# EAGLE design CiroAttuatore V1 (EAGLE 9.5.1)
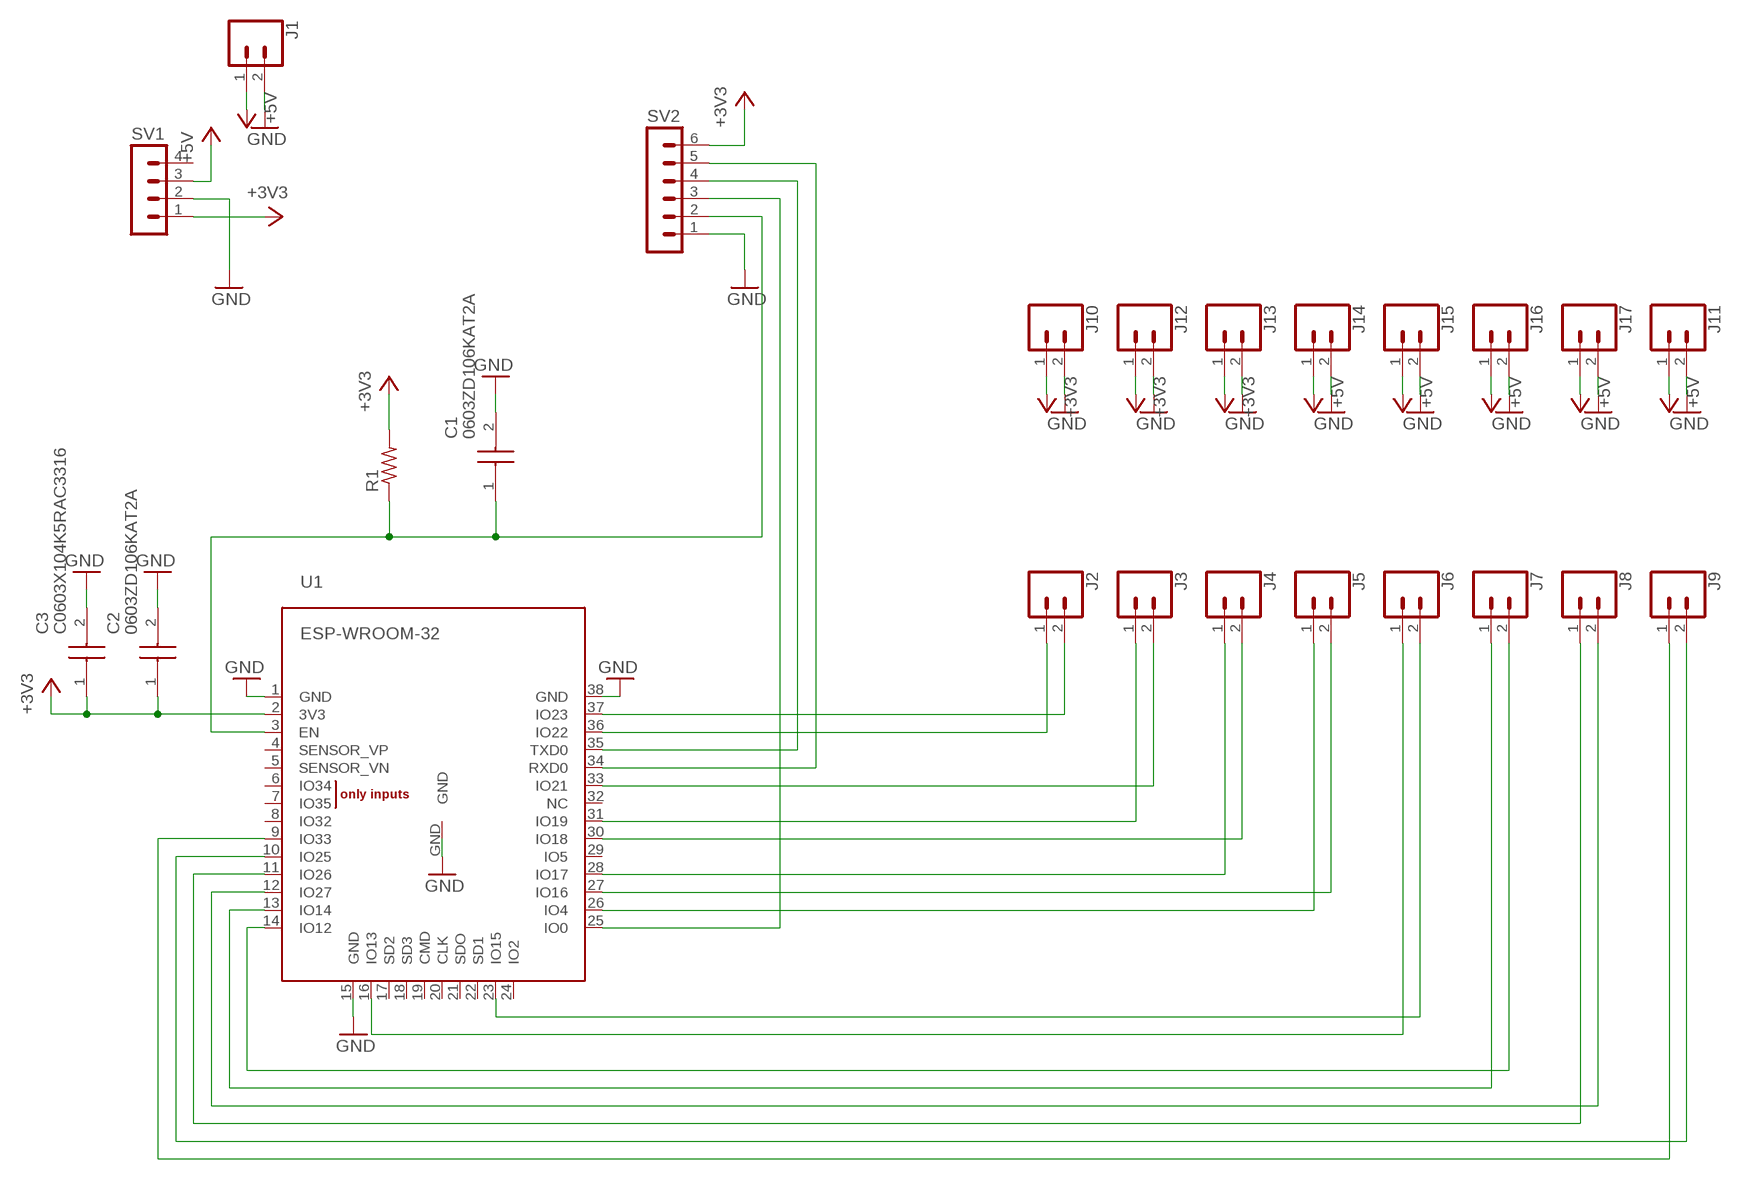
[diagram p0: schematic, sheet 1]

## Parts
C1  0603ZD106KAT2A  [CAPC1608X90N]
C2  0603ZD106KAT2A  [CAPC1608X90N]
C3  C0603X104K5RAC3316  [CAPC1608X95N]
J1  CONN_025MM  [SCREWTERMINAL-5MM-2]
J2  CONN_025MM  [SCREWTERMINAL-5MM-2]
J3  CONN_025MM  [SCREWTERMINAL-5MM-2]
J4  CONN_025MM  [SCREWTERMINAL-5MM-2]
J5  CONN_025MM  [SCREWTERMINAL-5MM-2]
J6  CONN_025MM  [SCREWTERMINAL-5MM-2]
J7  CONN_025MM  [SCREWTERMINAL-5MM-2]
J8  CONN_025MM  [SCREWTERMINAL-5MM-2]
J9  CONN_025MM  [SCREWTERMINAL-5MM-2]
J10  CONN_025MM  [SCREWTERMINAL-5MM-2]
J11  CONN_025MM  [SCREWTERMINAL-5MM-2]
J12  CONN_025MM  [SCREWTERMINAL-5MM-2]
J13  CONN_025MM  [SCREWTERMINAL-5MM-2]
J14  CONN_025MM  [SCREWTERMINAL-5MM-2]
J15  CONN_025MM  [SCREWTERMINAL-5MM-2]
J16  CONN_025MM  [SCREWTERMINAL-5MM-2]
J17  CONN_025MM  [SCREWTERMINAL-5MM-2]
R1  R-US_R0603  [R0603]
SV1  MA04-1  [MA04-1]
SV2  MA06-1  [MA06-1]
U1  ESP-WROOM-32  [ESP-WROOM-32]

## Nets
+3V3: C2.1 C3.1 J10.1 J12.1 J13.1 R1.2 SV1.1 SV2.6 U1.2(3V3)
+5V: J1.1 J11.1 J14.1 J15.1 J16.1 J17.1 SV1.3
GND: C1.2 C2.2 C3.2 J1.2 J10.2 J11.2 J12.2 J13.2 J14.2 J15.2 J16.2 J17.2 SV1.2 SV2.1 U1.1(GND) U1.15(GND) U1.38(GND) U1.GND
N$1: J2.2 U1.37(IO23)
N$2: J2.1 U1.36(IO22)
N$4: J3.2 U1.33(IO21)
N$5: SV2.4 U1.35(TXD0)
N$6: SV2.5 U1.34(RXD0)
N$7: SV2.3 U1.25(IO0)
N$8: C1.1 R1.1 SV2.2 U1.3(EN)
N$9: J3.1 U1.31(IO19)
N$10: J4.2 U1.30(IO18)
N$11: J4.1 U1.28(IO17)
N$12: J5.2 U1.27(IO16)
N$13: J5.1 U1.26(IO4)
N$14: J6.2 U1.23(IO15)
N$15: J6.1 U1.16(IO13)
N$16: J7.2 U1.14(IO12)
N$17: J7.1 U1.13(IO14)
N$18: J8.2 U1.12(IO27)
N$19: J8.1 U1.11(IO26)
N$20: J9.2 U1.10(IO25)
N$21: J9.1 U1.9(IO33)
Unconnected: SV1.4 U1.4(SENSOR_VP) U1.5(SENSOR_VN) U1.6(IO34) U1.7(IO35) U1.8(IO32) U1.17(SD2) U1.18(SD3) U1.19(CMD) U1.20(CLK) U1.21(SDO) U1.22(SD1) U1.24(IO2) U1.29(IO5) U1.32(NC)

## Library data of the parts
C1 C2 = SamacSys_Parts:0603ZD106KAT2A: Multilayer Ceramic Capacitors MLCC - SMD/SMT 10V 10uF X5R 0603 10%TOL Source: Datasheet <https://componentsearchengine.com/Datasheets/1/0603ZD106KAT2A.pdf>; DESCRIPTION: Multilayer Ceramic Capacitors MLCC - SMD/SMT 10V 10uF X5R 0603 10%TOL; HEIGHT: 0.9mm; MANUFACTURER_NAME: AVX; MANUFACTURER_PART_NUMBER: 0603ZD106KAT2A; MOUSER_PART_NUMBER: 581-0603ZD106KAT2A; MOUSER_PRICE-STOCK: https://www.mouser.com/Search/Refine.aspx?Keyword=581-0603ZD106KAT2A
C3 = SamacSys_Parts:C0603X104K5RAC3316: Multilayer Ceramic Capacitors MLCC - SMD/SMT 50V .1uF X7R AUTO 5mm Flex VW80808 Source: Datasheet <https://componentsearchengine.com/Datasheets/1/C0603X104K5RAC3316.pdf>; DESCRIPTION: Multilayer Ceramic Capacitors MLCC - SMD/SMT 50V .1uF X7R AUTO 5mm Flex VW80808; HEIGHT: 0.95mm; MANUFACTURER_NAME: Kemet; MANUFACTURER_PART_NUMBER: C0603X104K5RAC3316; MOUSER_PART_NUMBER: 80-C0603X104K5R3316; MOUSER_PRICE-STOCK: https://www.mouser.com/Search/Refine.aspx?Keyword=80-C0603X104K5R3316
J1-J17 = SparkFun-Connectors:CONN_02: Multi connection point. Often used as Generic Header-pin footprint for 0.1 inch spaced/style header connections On any of the 0.1 inch spaced packages, you can populate with these: Break Away Headers - Straight <https://www.sparkfun.com/products/116> (PRT-00116) Break Away Male Headers - Right Angle <https://www.sparkfun.com/products/553> (PRT-00553) Female Headers <https://www.sparkfun.com/products/115> (PRT-00115) Break Away Headers - Machine Pin <https://www.sparkfun.com/products/117> (PRT-00117) Break Away Female Headers - Swiss Machine Pin <https://www.sparkfun.com/products/743> (PRT-00743) For SCREWTERMINALS and SPRING TERMINALS visit here: Screw Terimnals on SparkFun.com <https://www.sparkfun.com/search/results?term=Screw+Terminals> (5mm/3.5mm/2.54mm spacing) This device is also useful as a general connection point to wire up your design to another part of your project. Our various solder wires solder well into these plated through hole pads. Hook-Up Wire - Assortment (Stranded, 22 AWG) <https://www.sparkfun.com/products/11375> (PRT-11375) Hook-Up Wire - Assortment (Solid Core, 22 AWG) <https://www.sparkfun.com/products/11367> (PRT-11367) View the entire wire category on our website here <https://www.sparkfun.com/categories/141> Special notes: Molex polarized connector foot print use with: PRT-08233 with associated crimp pins and housings. 2.54_SCREWTERM for use with PRT-10571. 3.5mm Screw Terminal footprints for PRT-08084 5mm Screw Terminal footprints for use with PRT-08432; SF_SKU: PRT-08432
R1 = resistor:R-US_: RESISTOR, American symbol
SV1 = con-lstb:MA04-1: PIN HEADER; OC_FARNELL: unknown; OC_NEWARK: unknown
SV2 = con-lstb:MA06-1: PIN HEADER; OC_FARNELL: unknown; OC_NEWARK: unknown
U1 = esp32:ESP-WROOM-32

## Board
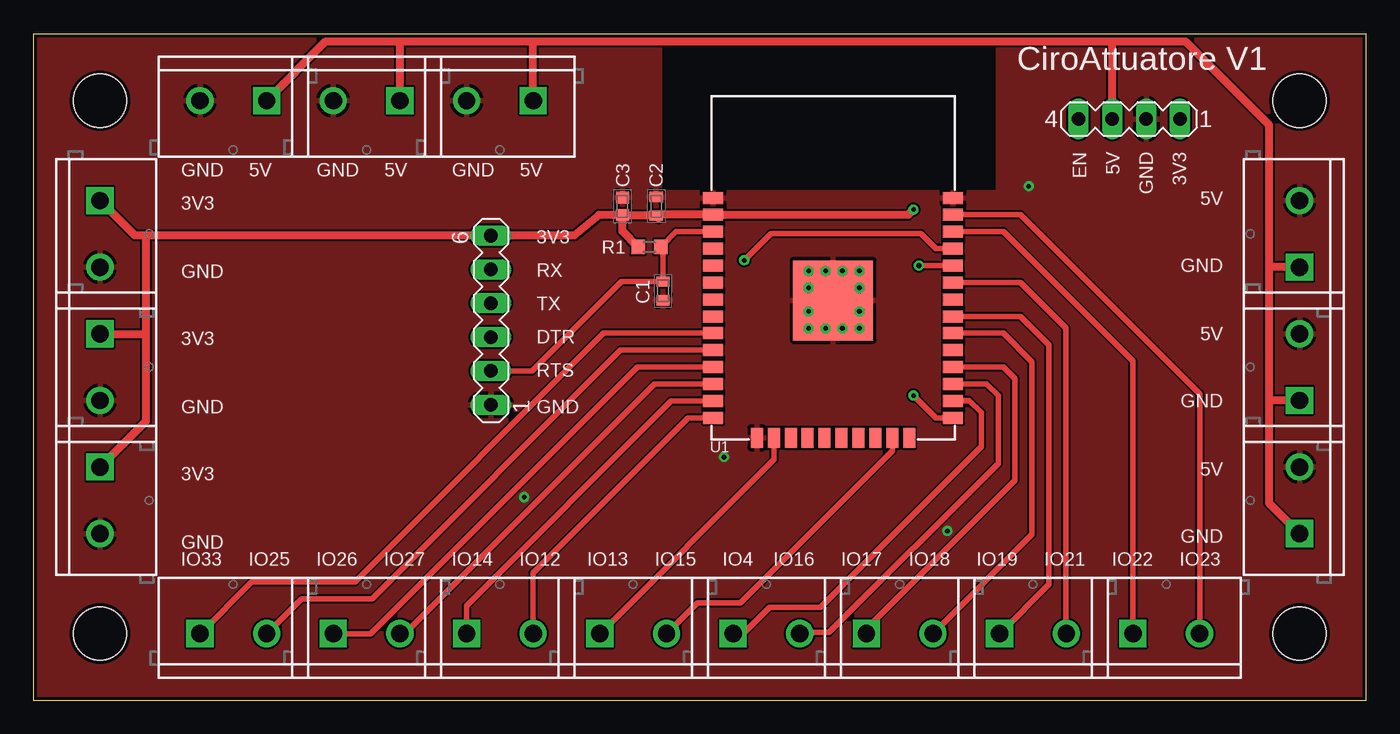
[diagram p1: board, top side]
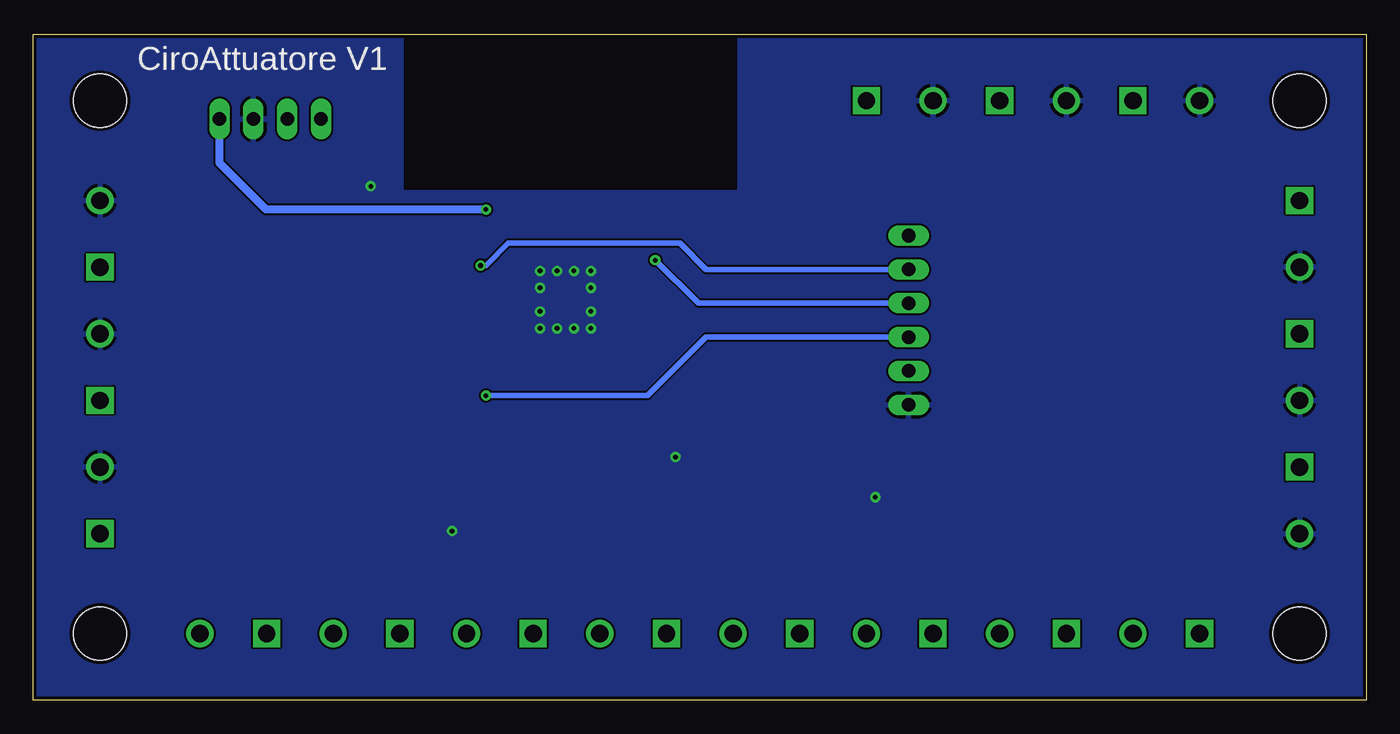
[diagram p2: board, bottom side, seen from below]

Size 100 x 50 mm. Coordinates in mm from the lower left corner, seen from the top.
Outline: 0,0 100,0 100,50 0,50 0,0
Copper layers (1*16): Top 0.035mm / dielectric 1.5mm / Bottom 0.035mm
Design rules "default *": minimum track width 6mil, minimum drill 0.35mm, track to track 6mil, track to pad 6mil, pad to pad 6mil, via to via 6mil, smd to smd 6mil, copper to edge 10mil, drill to drill 6mil, minimum pad ring 10mil, minimum via ring 8mil, stop-mask expansion 4mil, vias tented up to drill 0mil, thermal gap 10mil
Holes 4 mm at 95,45 5,45 5,5 95,5

### Footprints (pad centres in the part's own frame; a part is rotated, then mirrored left to right if it is on the bottom)
CAPC1608X90N = smd 0.78 x 0.99: 1 -0.7,0; 2 0.7,0
CAPC1608X95N = smd 0.89 x 0.98: 1 -0.65,0; 2 0.65,0
SCREWTERMINAL-5MM-2 = drill 1.3 pad 2.032 square: 1 0,0 | drill 1.3 pad 2.032: 2 5,0
R0603 = smd 1 x 1.1: 1 -0.85,0; 2 0.85,0
MA04-1 = drill 1.016 long: 1 -3.81,0; 2 -1.27,0; 3 1.27,0; 4 3.81,0
MA06-1 = drill 1.016 long: 1 -6.35,0; 2 -3.81,0; 3 -1.27,0; 4 1.27,0; 5 3.81,0; 6 6.35,0
ESP-WROOM-32 = smd 0.9 x 1.5: 1 7.7,9; 2 6.43,9; 3 5.16,9; 4 3.89,9; 5 2.62,9; 6 1.35,9; 7 0.08,9; 8 -1.19,9; 9 -2.46,9; 10 -3.73,9; 11 -5,9; 12 -6.27,9; 13 -7.54,9; 14 -8.81,9; 25 -8.81,-9; 26 -7.54,-9; 27 -6.27,-9; 28 -5,-9; 29 -3.73,-9; 30 -2.46,-9; 31 -1.19,-9; 32 0.08,-9; 33 1.35,-9; 34 2.62,-9; 35 3.89,-9; 36 5.16,-9; 37 6.43,-9; 38 7.7,-9 | smd 1.5 x 0.9: 15 -10.3,5.715; 16 -10.3,4.445; 17 -10.3,3.175; 18 -10.3,1.905; 19 -10.3,0.635; 20 -10.3,-0.635; 21 -10.3,-1.905; 22 -10.3,-3.175; 23 -10.3,-4.445; 24 -10.3,-5.715 | smd 6 x 6: GND 0,0

### Placement (x,y rotation side)
C1  47.24,30.72 270 top
C2  46.74,37.07 90 top
C3  44.2,37.07 90 top
J1  95,22.5 90 top
J2  82.5,5 0 top
J3  72.5,5 0 top
J4  62.5,5 0 top
J5  52.5,5 0 top
J6  42.5,5 0 top
J7  32.5,5 0 top
J8  22.5,5 0 top
J9  12.5,5 0 top
J10  5,37.5 270 top
J11  95,32.5 90 top
J12  5,17.5 270 top
J13  5,27.5 270 top
J14  95,12.5 90 top
J15  17.5,45 180 top
J16  27.5,45 180 top
J17  37.5,45 180 top
R1  46.23,34.02 180 top
SV1  82.22,43.62 180 top
SV2  34.33,28.52 90 top
U1  60,30 90 top

### Tracks (layer width: path | path; a pad name or v marks a point on that pad's centre or on a via)
+3V3  (via drill 0.35)
  Top 0.61: C3.1 44.25,36.37 C2.1 46.93,36.18 46.94,36.43 U1.2 65.64,36.43 v66.04,36.83 | R1.2 44.2,35.2 C3.1 | C3.1 42.43,36.42 40.59,34.87 SV2.6 8.45,34.87 | 8.45,34.87 7.63,34.87 J10.1 | J13.1 8.45,27.5 | J12.1 8.45,20.95 8.45,27.5 | 8.45,27.5 8.45,34.87
  Bottom 0.61: v66.04,36.83 82.55,36.83 86.03,40.31 SV1.1
+5V
  Top 0.61: J15.1 21.94,49.44 27.5,49.44 | J14.1 92.71,14.79 92.71,22.5 | 37.5,49.44 27.94,49.44 27.5,49.44 | 37.5,49.44 80.95,49.44 | 80.95,49.44 86.45,49.44 92.71,43.18 92.71,32.5 | 92.71,32.5 92.71,22.5 | J1.1 92.71,22.5 | J11.1 92.71,32.5 | SV1.3 80.95,49.44 | J17.1 37.5,49.44 | J16.1 27.5,49.44
GND  (via drill 0.35)
  other vias: 58.17,30.95 58.17,32.22 59.44,32.22 60.71,32.22 61.98,32.22 61.98,30.95 61.98,29.18 61.98,27.91 60.71,27.91 59.44,27.91 58.17,29.18 58.17,27.91 51.82,18.25 74.68,38.57 36.83,15.24 68.58,12.7
  pour Top: 0,0 0,50.8 46.99,50.8 46.99,38.1 72.39,38.1 72.39,50.8 100.33,50.8 100.33,0
  pour Bottom: 0,0 0,50.8 46.99,50.8 46.99,38.1 72.39,38.1 72.39,50.8 100.33,50.8 100.33,0
N$1
  Top 0.406: J2.2 87.5,22.99 74.06,36.43 U1.37
N$2
  Top 0.406: J2.1 82.5,25.45 72.79,35.16 U1.36
N$4
  Top 0.406: U1.33 74.06,31.35 77.47,27.94 77.47,5.03 J3.2
N$5  (via drill 0.35)
  Top 0.406: 69.44,34 U1.35 67.71,33.89 66.58,35.02 55.34,35.02 v53.34,33.02
  Bottom 0.406: SV2.4 50.11,29.79 v53.34,33.02
N$6  (via drill 0.35)
  Top 0.406: v66.44,32.62 U1.34
  Bottom 0.406: SV2.5 49.53,32.33 51.49,34.29 64.37,34.29 66.04,32.62 v66.44,32.62
N$7  (via drill 0.35)
  Top 0.406: v66.04,22.86 67.71,21.19 U1.25
  Bottom 0.406: SV2.3 49.53,27.25 53.92,22.86 v66.04,22.86
N$8
  Top 0.406: 47.36,34.16 47.35,33.75 R1.1 | R1.1 47.24,33.86 C1.1 44.12,31.42 37.41,24.71 SV2.2 | U1.3 48.22,35.16 R1.1
N$9
  Top 0.406: U1.31 74.06,28.81 76.2,26.67 76.2,8.7 J3.1
N$10
  Top 0.406: U1.30 72.79,27.54 74.93,25.4 74.93,12.43 J4.2
N$11
  Top 0.406: U1.28 72.79,25 73.66,24.13 73.66,16.51 62.5,5.35 J4.1
N$12
  Top 0.406: U1.27 71.52,23.73 72.39,22.86 72.39,17.78 59.69,5.08 57.5,5.08 J5.2
N$13
  Top 0.406: 70.21,22.5 69.02,22.5 69.02,22.45 | 70.21,22.5 71.12,21.59 71.12,19.05 59.05,6.99 55.24,6.99 53.26,5 J5.1 | U1.26 70.16,22.46 70.21,22.5
N$14
  Top 0.406: U1.23 64.44,18.73 53.05,7.33 49.83,7.33 J6.2
N$15
  Top 0.406: J6.1 55.55,18.05 U1.16
N$16
  Top 0.406: U1.14 49.13,21.19 37.5,9.56 J7.2
N$17
  Top 0.406: U1.13 47.86,22.46 32.5,7.1 J7.1
N$18
  Top 0.406: U1.12 46.59,23.73 27.86,5 J8.2
N$19
  Top 0.406: U1.11 45.32,25 25.32,5 J8.1
N$20
  Top 0.406: U1.10 44.05,26.27 25.4,7.62 20.12,7.62 J9.2
N$21
  Top 0.406: U1.9 42.78,27.54 24.13,8.89 16.39,8.89 J9.1

### Text on the board
tNames: CiroAttuatore V1 | EN | 5V | GND | 3V3 | GND | 5V | GND | 5V | GND | 5V | C3 | C2 | 5V | 3V3 | 3V3 | GND | GND | RX | C1 | TX | 5V | 3V3 | DTR | RTS | GND | GND | GND | 5V | 3V3 | GND | GND | IO33 | IO25 | IO26 | IO27 | IO14 | IO12 | IO13 | IO15 | IO4 | IO16 | IO17 | IO18 | IO19 | IO21 | IO22 | IO23
bNames: CiroAttuatore V1